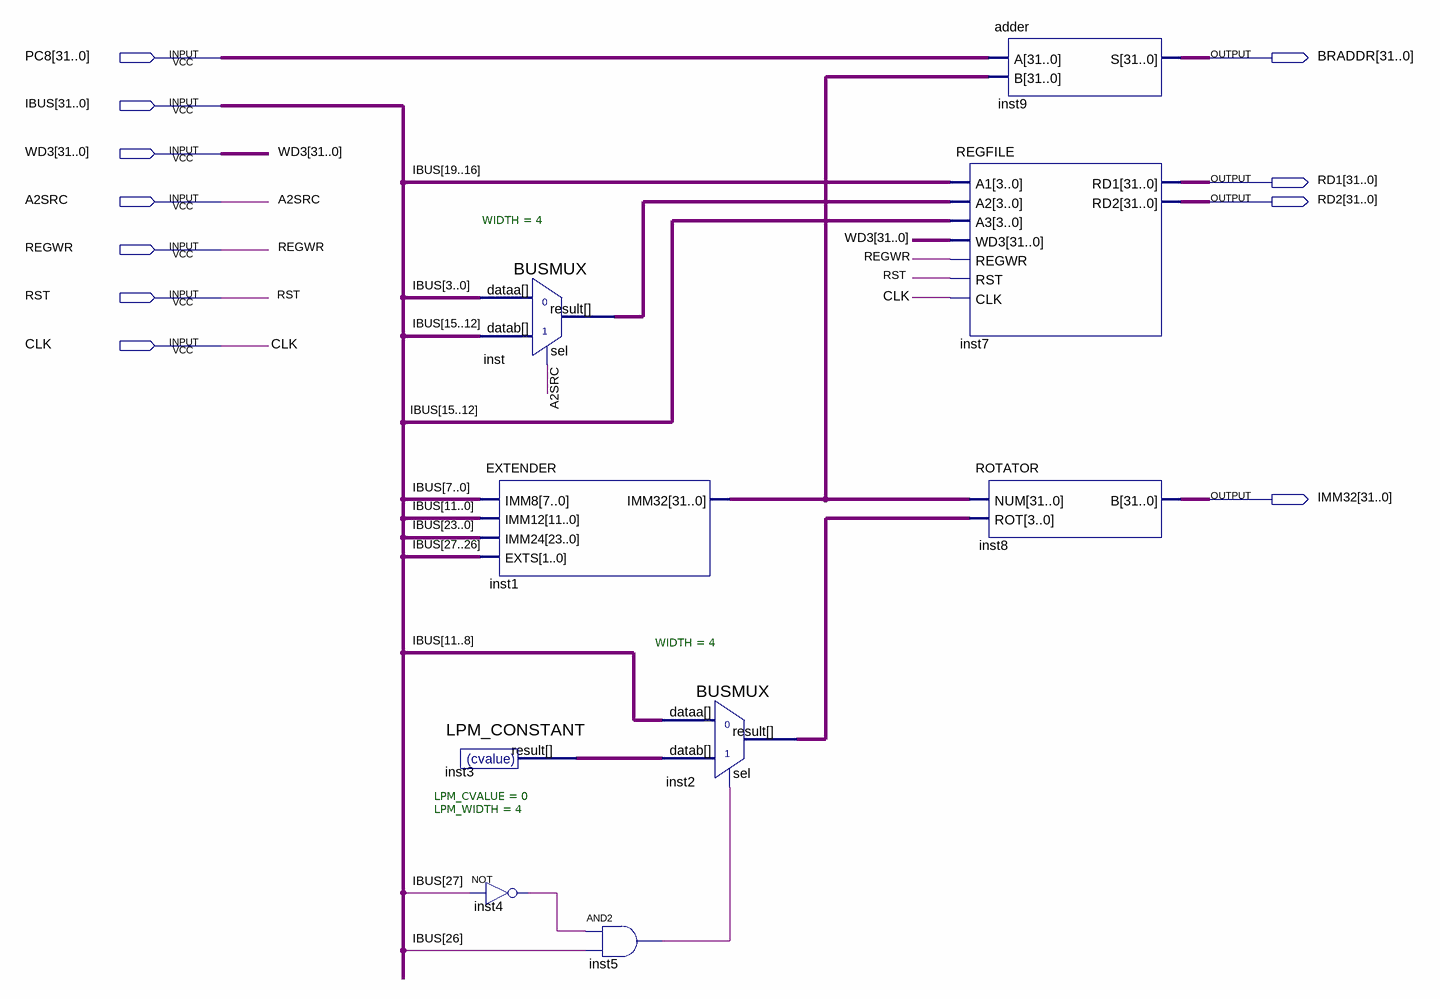
[diagram p0: schematic sheet]
// Quartus schematic decode.bdf as structural Verilog: 9 symbols, 11 pins
module decode (
  input  [31:0] PC8,
  input  [31:0] IBUS,
  input  [31:0] WD3,
  input  A2SRC,
  input  REGWR,
  input  RST,
  input  CLK,
  output [31:0] BRADDR,
  output [31:0] RD1,
  output [31:0] RD2,
  output [31:0] IMM32
);

  wire inst4_out, inst5_out;
  wire [3:0] inst2_result, inst3_result, inst_result;
  wire [31:0] inst1_imm32;

  LPM_CONSTANT #(.LPM_CVALUE(0), .LPM_WIDTH(4)) inst3 (.result(inst3_result));
  BUSMUX #(.WIDTH(4)) inst (.datab(IBUS[15:12]), .sel(A2SRC), .dataa(IBUS[3:0]), .result(inst_result));
  EXTENDER inst1 (.IMM8(IBUS[7:0]), .IMM12(IBUS[11:0]), .IMM24(IBUS[23:0]), .EXTS(IBUS[27:26]), .IMM32(inst1_imm32));
  not inst4 (inst4_out, IBUS[27]);
  and inst5 (inst5_out, inst4_out, IBUS[26]);
  BUSMUX #(.WIDTH(4)) inst2 (.datab(inst3_result), .sel(inst5_out), .dataa(IBUS[11:8]), .result(inst2_result));
  REGFILE inst7 (
    .A1(IBUS[19:16]), .A2(inst_result), .A3(IBUS[15:12]), .WD3(WD3), .REGWR(REGWR), .RST(RST), .CLK(CLK),
    .RD1(RD1), .RD2(RD2));
  ROTATOR inst8 (.NUM(inst1_imm32), .ROT(inst2_result), .B(IMM32));
  adder inst9 (.A(PC8), .B(inst1_imm32), .S(BRADDR));
endmodule
